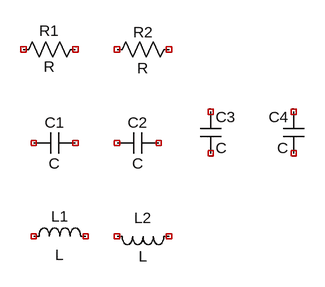
[diagram p0: schematic 21 - Position that need adjustments.asc]
21 - Position that need adjustments.asc, the LTspice schematic file:
Version 4.1
SHEET 1 880 732
SYMBOL res -736 384 R90
WINDOW 0 3 56 VBottom 2
WINDOW 3 27 56 VTop 2
SYMATTR InstName R1
SYMBOL res -704 416 R270
WINDOW 0 27 56 VTop 2
WINDOW 3 3 56 VBottom 2
SYMATTR InstName R2
SYMBOL cap -752 528 R90
WINDOW 0 0 32 VBottom 2
WINDOW 3 32 32 VTop 2
SYMATTR InstName C1
SYMBOL cap -688 560 R270
WINDOW 0 32 32 VTop 2
WINDOW 3 0 32 VBottom 2
SYMATTR InstName C2
SYMBOL cap -560 496 R0
SYMATTR InstName C3
SYMBOL cap -400 560 R180
WINDOW 0 24 56 Left 2
WINDOW 3 24 8 Left 2
SYMATTR InstName C4
SYMBOL ind -832 704 R270
WINDOW 3 3 56 VBottom 2
WINDOW 0 31 56 VTop 2
SYMATTR InstName L1
SYMBOL ind -592 672 R90
WINDOW 3 31 56 VTop 2
WINDOW 0 3 56 VBottom 2
SYMATTR InstName L2

The netlist it stands for:
* 21 - Position that need adjustments.asc
R1 NC_01 NC_02 R
R2 NC_03 NC_04 R
C1 NC_05 NC_06 C
C2 NC_07 NC_08 C
C3 NC_09 NC_10 C
C4 NC_11 NC_12 C
L1 NC_13 NC_14 L
L2 NC_15 NC_16 L
.backanno
.end